# EAGLE design Modular Assistive Technology Interface (EAGLE 9.6.2)
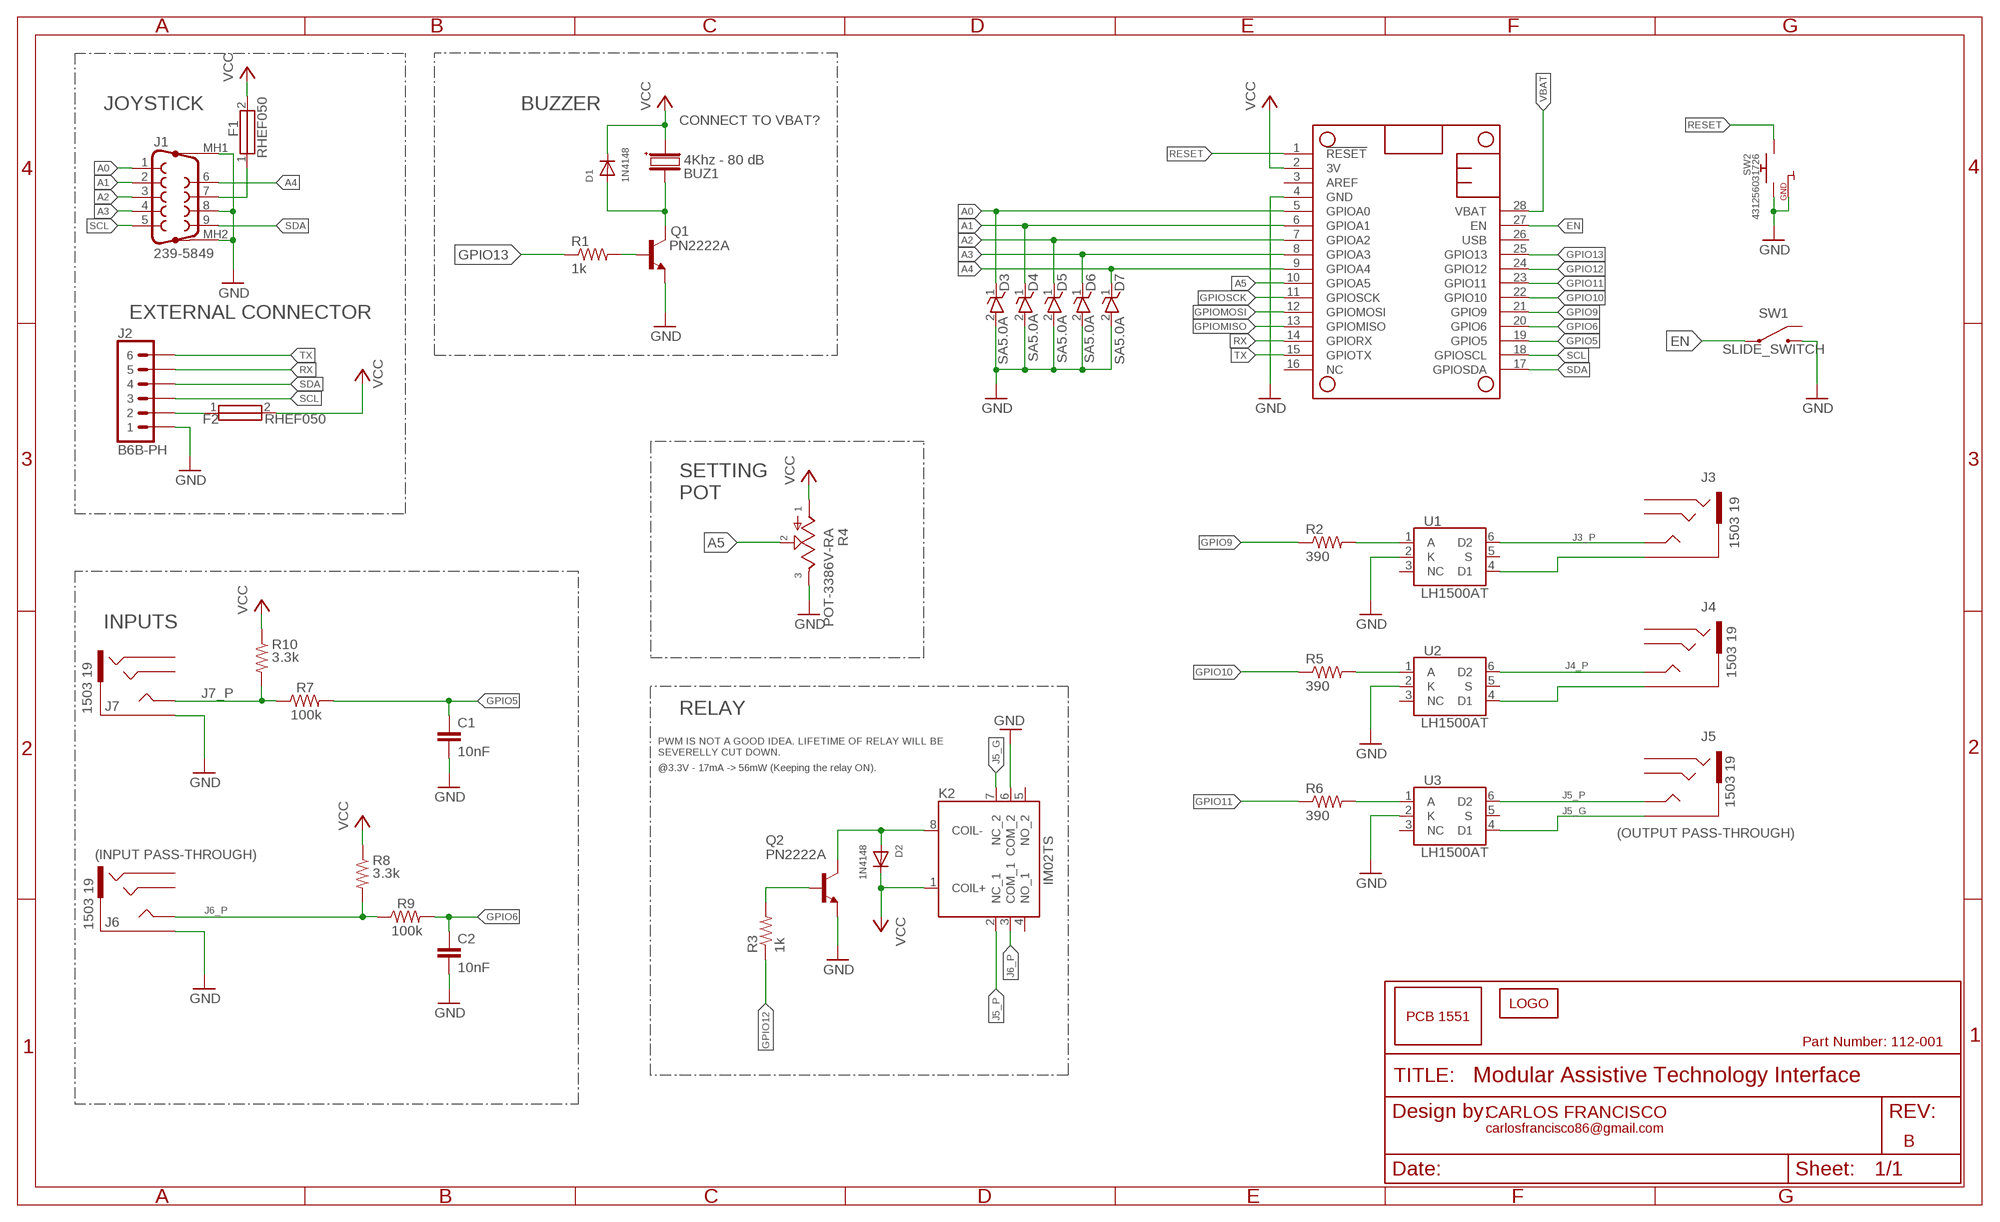
[diagram p0: schematic, sheet 1]

## Parts
BUZ1  4Khz - 80 dB  BUZZER-511-7620  [-511-7620]
C1  10nF  C-EU025-024X044  [C025-024X044]
C2  10nF  C-EU025-024X044  [C025-024X044]
D1  1N4148  DIODE-DO-35  [DO-1N4148]
D2  1N4148  DIODE-DO-35  [DO-1N4148]
D3  SA5.0A  ESD_DIODE  [DIOAD1910W86L670D310]
D4  SA5.0A  ESD_DIODE  [DIOAD1910W86L670D310]
D5  SA5.0A  ESD_DIODE  [DIOAD1910W86L670D310]
D6  SA5.0A  ESD_DIODE  [DIOAD1910W86L670D310]
D7  SA5.0A  ESD_DIODE  [DIOAD1910W86L670D310]
F1  RHEF050  [RHEF050]
F2  RHEF050  [RHEF050]
J1  239-5849  DB9_MALE-SLOTS  [DB9_PLUG_SLOT]
J2  B6B-PH  CONN_06-B6B-PH  [SHDR6W50P0X200_1X6_990X450X600]
J3  1503 19  STEREO_JACK-1503-19  [1503-19]
J4  1503 19  STEREO_JACK-1503-19  [1503-19]
J5  1503 19  STEREO_JACK-1503-19  [1503-19]
J6  1503 19  STEREO_JACK-1503-19  [1503-19]
J7  1503 19  STEREO_JACK-1503-19  [1503-19]
K2  IM02TS  IM02TS  [IM03TS114620378]
MS1  FEATHERWING_NODIM  [FEATHERWING_DIM]
Q1  PN2222A  NPN-TO-92  [TO92-EBC-OVAL]
Q2  PN2222A  NPN-TO-92  [TO92-EBC-OVAL]
R1  1k  R-US_0207/10  [0207/10]
R2  390  R-US_0207/10  [0207/10]
R3  1k  R-US_0207/10  [0207/10]
R4  POT-3386V-RA  [3386V1103LF]
R5  390  R-US_0207/10  [0207/10]
R6  390  R-US_0207/10  [0207/10]
R7  100k  R-US_0207/10  [0207/10]
R8  3.3k  R-US_0207/10  [0207/10]
R9  100k  R-US_0207/10  [0207/10]
R10  3.3k  R-US_0207/10  [0207/10]
SW1  SLIDE_SWITCH  [OS102011MA1QN1]
SW2  431256031726  SPST-RA  [SERIES95C_RA]
U1  LH1500AT  SSR-LH1500AT  [DIP762W47P254L880H410Q6N]
U2  LH1500AT  SSR-LH1500AT  [DIP762W47P254L880H410Q6N]
U3  LH1500AT  SSR-LH1500AT  [DIP762W47P254L880H410Q6N]
U$2  LOGO-10MM  [LOGO_10MM]
U$3  PCB_1551-1551  [PCB]

## Nets
A0: D3.1(K) J1.1 MS1.5(GPIOA0)
A1: D4.1(K) J1.2 MS1.6(GPIOA1)
A2: D5.1(K) J1.3 MS1.7(GPIOA2)
A3: D6.1(K) J1.4 MS1.8(GPIOA3)
A4: D7.1(K) J1.6 MS1.9(GPIOA4)
A5: MS1.10(GPIOA5) R4.2
BUZ_CTRL_R: Q1.B R1.2
EN: MS1.27(EN) SW1.2
GND: C1.2 C2.2 D3.2(A) D4.2(A) D5.2(A) D6.2(A) D7.2(A) J1.8 J1.MH1(G1) J1.MH2(G2) J2.1 J6.1 J7.1 K2.6(COM_2) MS1.4(GND) Q1.E Q2.E R4.3 SW1.1 SW2.F1(GND) SW2.F2(GND) SW2.T2(SW2) U1.2(K) U2.2(K) U3.2(K)
GPIO5: C1.1 MS1.19(GPIO5) R7.2
GPIO6: C2.1 MS1.20(GPIO6) R9.2
GPIO9: MS1.21(GPIO9) R2.1
GPIO10: MS1.22(GPIO10) R5.1
GPIO11: MS1.23(GPIO11) R6.1
GPIO12: MS1.24(GPIO12) R3.1
GPIO13: MS1.25(GPIO13) R1.1
GPIOMISO: MS1.13(GPIOMISO)
GPIOMOSI: MS1.12(GPIOMOSI)
GPIOSCK: MS1.11(GPIOSCK)
J3_P: J3.4 J3.5 U1.6(D2)
J4_P: J4.4 J4.5 U2.6(D2)
J5_G: J5.1 K2.7(NC_2) U3.4(D1)
J5_P: J5.4 J5.5 K2.2(NC_1) U3.6(D2)
J6_P: J6.4 J6.5 K2.3(COM_1) R8.2 R9.1
J7_P: J7.4 J7.5 R7.1 R10.2
N$1: BUZ1.- D1.A Q1.C
N$2: J3.1 U1.4(D1)
N$3: J4.1 U2.4(D1)
N$6: R2.2 U1.1(A)
N$8: R5.2 U2.1(A)
N$10: R6.2 U3.1(A)
N$13: F2.1 J2.2
N$14: D2.A K2.8(COIL-) Q2.C
N$19: Q2.B R3.2
N$20: F1.1 J1.7
RESET: MS1.1(!RESET) SW2.T1(SW1)
RX: J2.5 MS1.14(GPIORX)
SCL: J1.5 J2.3 MS1.18(GPIOSCL)
SDA: J1.9 J2.4 MS1.17(GPIOSDA)
TX: J2.6 MS1.15(GPIOTX)
VBAT: MS1.28(VBAT)
VCC: BUZ1.+ D1.C D2.C F1.2 F2.2 K2.1(COIL+) MS1.2(3V) R4.1 R8.1 R10.1
Unconnected: J3.2 J3.3 J4.2 J4.3 J5.2 J5.3 J6.2 J6.3 J7.2 J7.3 K2.4(NO_1) K2.5(NO_2) MS1.3(AREF) MS1.16(NC) MS1.26(USB) SW1.3 U1.3(NC) U1.5(S) U2.3(NC) U2.5(S) U3.3(NC) U3.5(S)

## Notes on the sheet
- JOYSTICK | BUZZER
- CONNECT TO VBAT?
- EXTERNAL CONNECTOR
- SETTING
  POT
- INPUTS
- RELAY
- PWM IS NOT A GOOD IDEA. LIFETIME OF RELAY WILL BE
  SEVERELLY CUT DOWN.
- @3.3V - 17mA -> 56mW (Keeping the relay ON).
- (OUTPUT PASS-THROUGH)
- (INPUT PASS-THROUGH)
- Part Number: 112-001
- CARLOS FRANCISCO
- carlosfrancisco86@gmail.com
- B

## Library data of the parts
BUZ1 = AceCenter:BUZZER: Buzzer; DESCRIPTION: 80dB PCB Buzzer; MFR: RS PRO; MFR_NUM: 511-7620
C1 C2 = rcl:C-EU: CAPACITOR, European symbol; SPICEPREFIX: C
D1 D2 = AceCenter:DIODE: General purpose diode; DESCRIPTION: Switching Diode, 400mA 100V, 2-Pin DO-35; MFR: ON Semiconductor; MFR_NUM: 1N4148TR; VENDOR_NUM: 671-5477
D3-D7 = AceCenter:ESD_DIODE: Littelfuse SA5.0A, Uni-Directional TVS Diode, 500W, 2-Pin DO-204AC Source: Datasheet <http://www.littelfuse.com/~/media/electronics/datasheets/tvs_diodes/littelfuse_tvs_diode_sa_datasheet.pdf.pdf>; DESCRIPTION: Littelfuse SA5.0A, Uni-Directional TVS Diode, 500W, 2-Pin DO-204AC; MFR: Littelfuse; MFR_NUM: SA5.0A; VENDOR: RS-ONLINE; VENDOR_NUM: 764-5521
F1 F2 = AceCenter:RHEF050: TE Connectivity 0.5A Radial Leaded PCB Mount Resettable Fuse, 30 V Source: Datasheet <http://www.littelfuse.com/~/media/electronics/product_specifications/resettable_ptcs/littelfuse_ptc_rhef050_product_specification.pdf.pdf>; ARROW_PART_NUMBER: RHEF050; DESCRIPTION: TE Connectivity 0.5A Radial Leaded PCB Mount Resettable Fuse, 30 V; HEIGHT: 12mm; MANUFACTURER_NAME: TE Connectivity; MANUFACTURER_PART_NUMBER: RHEF050
J1 = AceCenter:DB9_MALE: D-SUB Connector - Right Angle; DESCRIPTION: D-sub Connector - 2.77mm Pitch; MFR: RS Pro; MFR_NUM: 239-5849; VENDOR: RS-Online; VENDOR_NUM: 239-5849
J2 = AceCenter:CONN_06; DESCRIPTION: JST, PH, B6B, 6 Way, 1 Row, Straight PCB Header; MFR: JST; MFR_NUM: B6B-PH-K-S(LF)(SN); VENDOR: RS-ONLINE; VENDOR_NUM: 820-1447
J3-J7 = AceCenter:STEREO_JACK: 3.5 mm PCB Mount Stereo Jack Socket; DESCRIPTION: Lumberg 3.5 mm PCB Mount Stereo Jack Socket, 4Pole 1A; MFR: Lumberg; MFR_NUM: 1503 19; VENDOR: RS-ONLINE; VENDOR_NUM: 124-8885
K2 = AceCenter:IM02TS: DPDT telecom PCB relay, 2A 5Vdc coil, EA Source: Datasheet <http://uk.rs-online.com/web/p/products/4227029>; DESCRIPTION: DPDT telecom PCB relay, 2A 5Vdc coil, EA; MANUFACTURER_NAME: TE Connectivity; MANUFACTURER_PART_NUMBER: IM03TS 1-1462037-8
MS1 = AceCenter:FEATHERWING
Q1 Q2 = AceCenter:NPN; DESCRIPTION: NPN General-Purpose Amplifier; MFR: ON Semiconductor; MFR_NUM: PN2222ABU; VENDOR: RS-ONLINE; VENDOR_NUM: 739-0555
R1-R3 R5-R10 = rcl:R-US_: RESISTOR, American symbol; SPICEPREFIX: R
R4 = AceCenter:POT: Bourns 3386P Series Through Hole Cermet Trimmer Resistor with Solder Pin Terminations, 20 +/-10% 0.5W +/-100ppm/C Source: Datasheet <https://www.bourns.com/docs/Product-Datasheets/3386.pdf>
SW1 = AceCenter:SLIDE_SWITCH: Switch Slide Right Angle SPDT 0.1A 12VDC Through Hole Slide Switch SPDT On-On 0.1 A@ 12 V dc Slide Source: Datasheet <http://www.ckswitches.com/media/1428/os.pdf>; ARROW_PART_NUMBER: OS102011MA1QN1; ARROW_PRICE-STOCK: https://www.arrow.com/en/products/os102011ma1qn1/ck; DESCRIPTION: Switch Slide Right Angle SPDT 0.1A 12VDC Through Hole Slide Switch SPDT On-On 0.1 A@ 12 V dc Slide; HEIGHT: mm; MANUFACTURER_NAME: C & K COMPONENTS; MANUFACTURER_PART_NUMBER: OS102011MA1QN1; MOUSER_PART_NUMBER: 611-OS102011MA1QN1; MOUSER_PRICE-STOCK: https://www.mouser.co.uk/ProductDetail/CK/OS102011MA1QN1?qs=WtljUlYws5R6MUgHcLkz4w%3D%3D
SW2 = AceCenter:SPST; DESCRIPTION: Tactile Switch, Single Pole Single Throw (SPST) 50 mA @ 12 V; MFR: Wurth Elektronik; MFR_NUM: 431256031726; VENDOR: RS-ONLINE; VENDOR_NUM: 785-6386
U1-U3 = AceCenter:SSR: Vishay 1 Form A Solid-State Relay (Normally Open); DESCRIPTION: 1 Form A Solid-State Relay (NO); MFR: Vishay; MFR_NUM: LH1500AT; VENDOR: RS-ONLINE; VENDOR_NUM: 180-8794
U$2 = AceCenter:LOGO
U$3 = AceCenter:PCB_1551

## Board
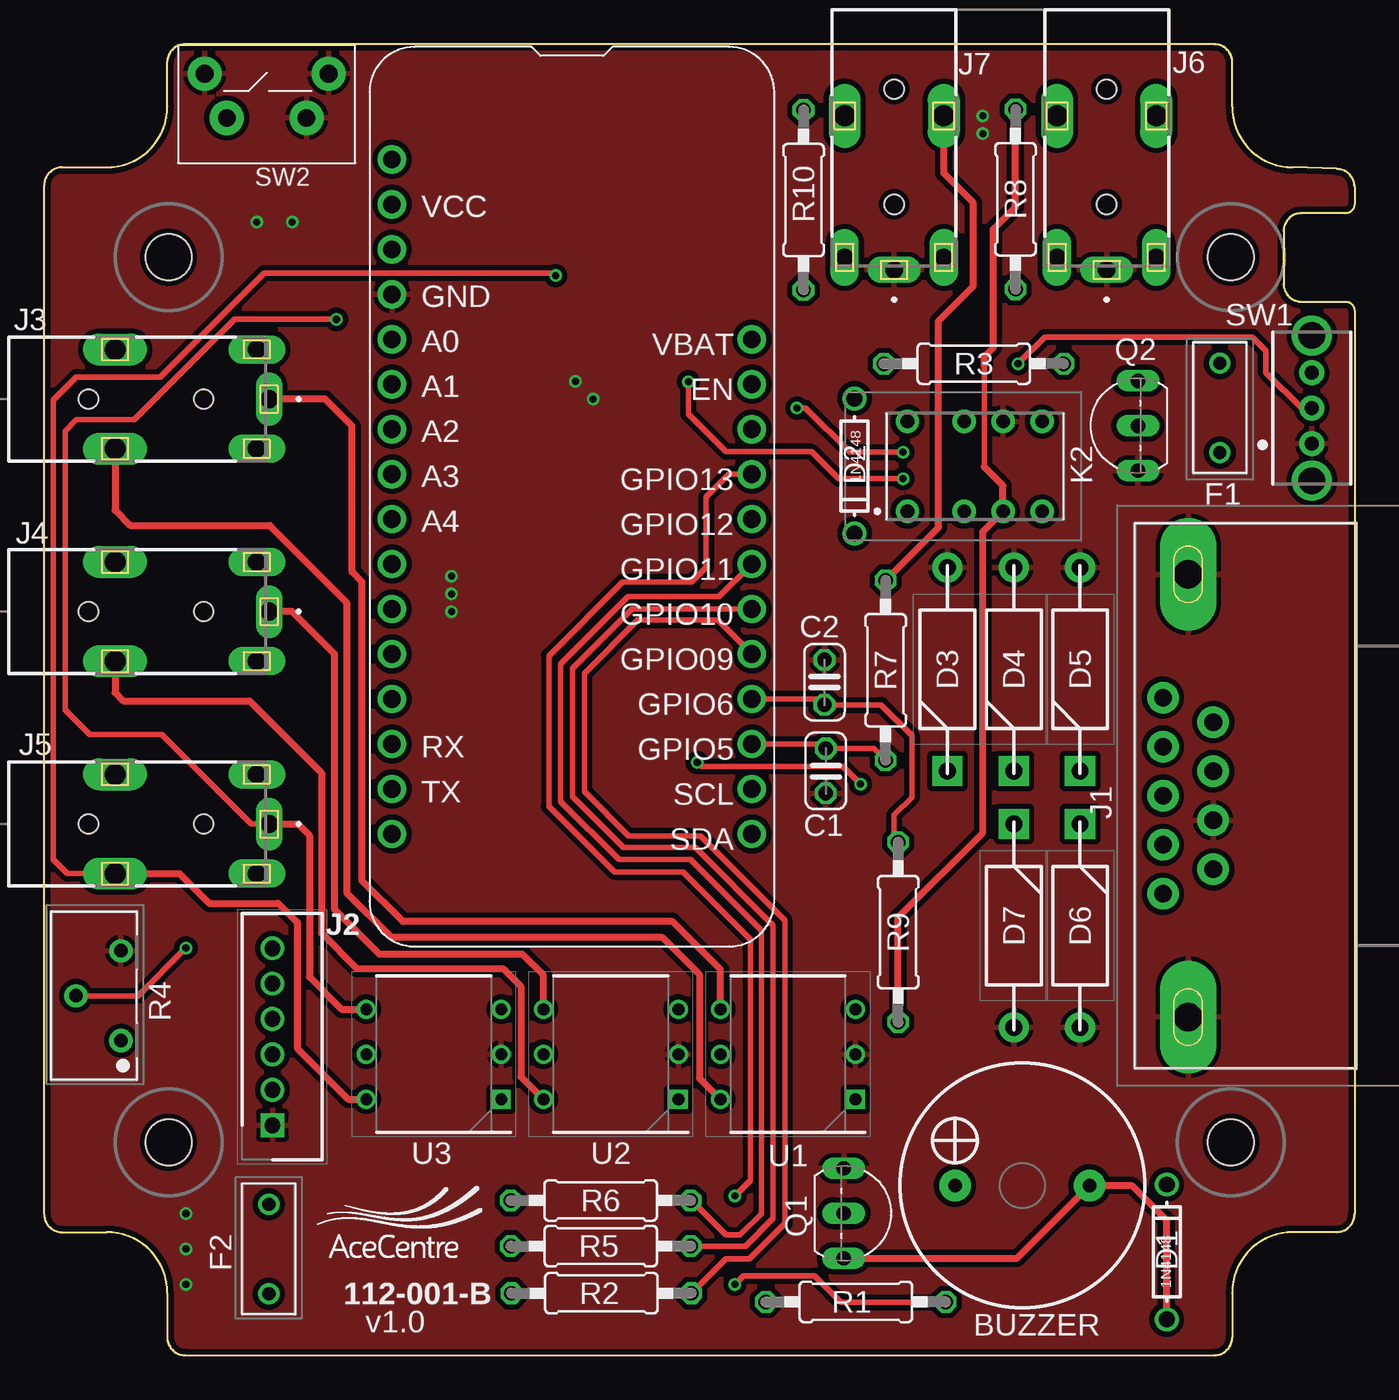
[diagram p1: board, top side]
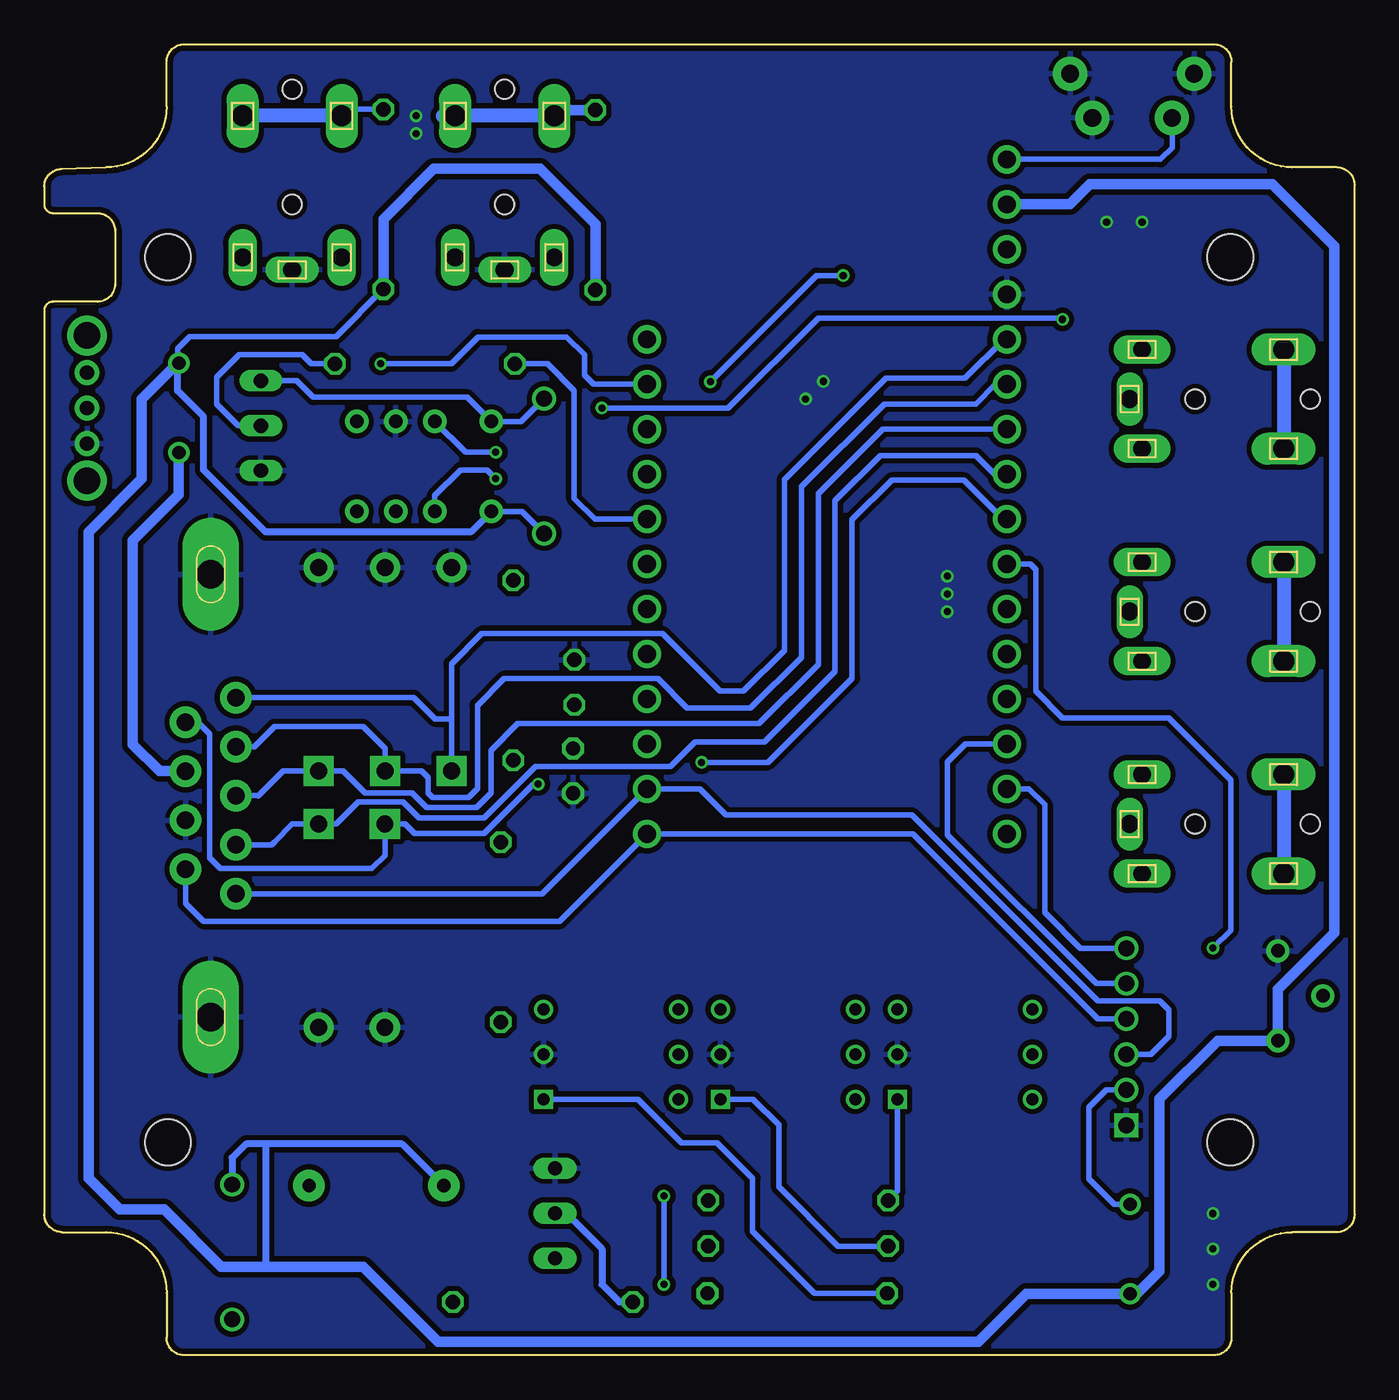
[diagram p2: board, bottom side, seen from below]

Size 74 x 74.04 mm. Coordinates in mm from the lower left corner, seen from the top.
Copper layers (1*16): Top 0.035mm / dielectric 1.5mm / Bottom 0.035mm
Design rules "SparkFun-2-layer-PCBWay-LIMIT": minimum track width 6mil, minimum drill 0.3mm, track to track 6mil, track to pad 6mil, pad to pad 6mil, via to via 6mil, smd to smd 6mil, copper to edge 6mil, drill to drill 6mil, minimum pad ring 6mil, minimum via ring 6mil, stop-mask expansion 4mil, vias tented up to drill 25mil, thermal gap 10mil

### Footprints (pad centres in the part's own frame; a part is rotated, then mirrored left to right if it is on the bottom)
-511-7620 = drill 0.75 pad 1.778: + 0,3.8; - 0,-3.8
C025-024X044 = drill 0.813 octagon: 1 -1.27,0; 2 1.27,0
DO-1N4148 = drill 0.9: A -3.81,0; C 3.81,0
DIOAD1910W86L670D310 = drill 0.95 pad 1.7 square: 1 0,0 | drill 0.95 pad 1.7: 2 11.48,0
RHEF050 = drill 0.75 pad 1.2: 1 -2.525,0; 2 2.525,0
DB9_PLUG_SLOT = drill 1 pad 1.778: 1 0,0; 2 -2.77,0; 3 -5.54,0; 4 -8.31,0; 5 -11.08,0; 6 -1.385,-2.84; 7 -4.155,-2.84; 8 -6.925,-2.84; 9 -9.695,-2.84 | drill 1.6 pad 3.2 long: MH1 -18.04,-1.42; MH2 6.96,-1.42
SHDR6W50P0X200_1X6_990X450X600 = drill 0.9 pad 1.35 square: 1 0,0 | drill 0.9 pad 1.35: 2 -2,0; 3 -4,0; 4 -6,0; 5 -8,0; 6 -10,0
1503-19 = drill 1 pad 1.5 long: 1 14.7,0 | drill 1 pad 1.6 long: 2 14,2.8; 3 14,-2.8 | drill 1.2 pad 1.8 long: 4 6,2.8; 5 6,-2.8 | hole 1.1: 4.5,0; 11,0
IM03TS114620378 = drill 0.77 pad 1.32: 1 0,0; 2 3.2,0; 3 5.4,0; 4 7.6,0; 5 7.6,5.08; 6 5.4,5.08; 7 3.2,5.08; 8 0,5.08
FEATHERWING_DIM = drill 1 pad 1.6: 1 6.35,1.27; 2 8.89,1.27; 3 11.43,1.27; 4 13.97,1.27; 5 16.51,1.27; 6 19.05,1.27; 7 21.59,1.27; 8 24.13,1.27; 9 26.67,1.27; 10 29.21,1.27; 11 31.75,1.27; 12 34.29,1.27; 13 36.83,1.27; 14 39.37,1.27; 15 41.91,1.27; 16 44.45,1.27; 17 44.45,21.59; 18 41.91,21.59; 19 39.37,21.59; 20 36.83,21.59; 21 34.29,21.59; 22 31.75,21.59; 23 29.21,21.59; 24 26.67,21.59; 25 24.13,21.59; 26 21.59,21.59; 27 19.05,21.59; 28 16.51,21.59
TO92-EBC-OVAL = drill 0.813 long: B 0,-1.27; C 2.54,-1.27; E -2.54,-1.27
0207/10 = drill 0.813 octagon: 1 -5.08,0; 2 5.08,0
3386V1103LF = drill 0.76 pad 1.303: 1 0,0; 2 2.54,2.54; 3 5.08,0
OS102011MA1QN1 = drill 0.8 pad 1.4: 1 -2,0; 2 0,0; 3 2,0 | drill 1.5 pad 2.25: 4 -4.1,0; 5 4.1,0
SERIES95C_RA = drill 1 pad 1.93: F1 -3.5,2.5; F2 3.5,2.5; T1 -2.25,0; T2 2.25,0
DIP762W47P254L880H410Q6N = drill 0.67 pad 1.07 square: 1 -3.81,2.54 | drill 0.67 pad 1.07: 2 -3.81,0; 3 -3.81,-2.54; 4 3.81,-2.54; 5 3.81,0; 6 3.81,2.54
PCB = hole 2.6: 7.02,12.02; 67.02,12.02; 7.02,62.02; 67.02,62.02

### Placement (x,y rotation side)
BUZ1  55.24,9.58 90 top
C1  44.13,33 270 top
C2  44.06,38 90 top
D1  63.4,5.83 90 top
D2  45.76,50.23 270 top
D3  51,33 90 top
D4  54.75,33 90 top
D5  58.5,33 90 top
D6  58.5,30 270 top
D7  54.76,30 270 top
F1  66.4,53.51 90 top
F2  12.68,6 270 top
J1  63.18,37.14 90 top
J2  12.88,12.99 270 top
J3  -2,54 0 top
J4  -2,42 0 top
J5  -2,30 0 top
J6  60,76 270 top
J7  48,76 270 top
K2  48.75,47.66 0 top
MS1  18.37,73.89 270 top
Q1  46.42,8.02 270 top
Q2  60.5,52.5 90 top
R1  45.84,3.01 180 top
R2  31.46,3.5 180 top
R3  52.5,56 0 top
R4  4.33,17.77 90 top
R5  31.43,6.17 180 top
R6  31.42,8.74 180 top
R7  47.51,38.68 270 top
R8  54.85,65.29 90 top
R9  48.22,23.9 90 top
R10  42.88,65.24 90 top
SW1  71.59,53.49 90 top
SW2  12.56,69.88 0 top
U1  42,17 180 top
U2  32,17 180 top
U3  22,17 180 top
U$2  15.39,5.42 0 top
U$3  0,0 0 top

### Tracks (layer width: path | path; a pad name or v marks a point on that pad's centre or on a via)
A0
  Bottom 0.3: 51,35.94 D3.1 | MS1.5 19.79,57.38 21.99,55.17 26.46,55.17 32.19,49.44 32.19,39.81 34.5,37.5 35.85,37.5 39.1,40.75 49.3,40.75 51,39.04 51,35.94 | 51,35.94 51.94,35.94 53,37 53.12,37.12 53.14,37.14 J1.1
A1
  Bottom 0.3: MS1.6 20.27,54.84 21.39,53.72 26.56,53.72 31.24,49.05 31.24,39.42 34.1,36.55 37.69,36.55 39.35,38.21 48.03,38.21 49.53,36.7 49.53,32 50.04,31.5 52.07,31.5 52.32,31.75 52.32,32.64 52.69,33 D4.1 54.75,34.25 56,35.5 61,35.5 62.15,34.35 62.17,34.37 J1.2
A2
  Bottom 0.3: 61.92,31.58 61.9,31.6 | MS1.7 26.64,52.3 30.29,48.65 30.29,39.02 33.64,35.67 47.26,35.67 48.77,34.16 48.77,31.75 49.59,30.93 52.4,30.93 53.21,31.75 55.88,31.75 57.13,33 D5.1 60.5,33 61.75,31.75 61.9,31.6 | J1.3 61.9,31.6
A3
  Bottom 0.3: 61.19,28.81 61.17,28.83 | MS1.8 20.34,49.76 21.39,50.82 26.77,50.82 29.33,48.26 29.33,38.63 33.32,34.64 37.24,34.64 38.63,33.25 46.25,33.25 49.16,30.35 52.83,30.35 53.72,31.24 56.26,31.24 57.5,30 D6.1 60,30 61,29 61.17,28.83 | J1.4 61.17,28.83
A4  (via drill 0.4)
  Top 0.3: v46.1,32.26 45.1,33.25 37.11,33.25 v36.88,33.48
  Bottom 0.3: MS1.9 19.85,47.22 22.05,49.42 26.14,49.42 28.38,47.19 28.38,38.23 33.13,33.48 v36.88,33.48 | v46.1,32.26 46.35,32.26 49.15,29.46 53.09,29.46 53.62,30 D7.1 54.76,28.24 55.5,27.5 64.08,27.5 64.67,28.09 64.67,35.09 65.33,35.76 J1.6
A5  (via drill 0.4)
  Top 0.3: R4.2 5.31,20.31 v8,23
  Bottom 0.3: MS1.10 18.32,44.68 18,44.36 18,37.5 16.5,36 10.5,36 7,32.5 7,24 v8,23
BUZ_CTRL_R
  Bottom 0.4: Q1.B 44.52,8.02 42.5,6 42.5,4 41.51,3.01 R1.2
EN  (via drill 0.4)
  Top 0.3: SW1.2 71.01,53.49 69,55.5 69,56.73 68.23,57.5 56.5,57.5 v55,56
  Bottom 0.3: v55,56 51,56 49.5,57.5 44.5,57.5 43.5,56.5 43.5,55.37 42.98,54.84 MS1.27
GND  (via drill 0.4)
  other vias: 8,6 8,4 8,8 12,64 14,64 23,44 23,43 23,42 30,55 31,54 53,69 53,70
  pour Top (isolate 0.3): 4,74 70,74 arc-90 74,70 74,1 arc-90 73,0 0,0 0,70 arc-90
  pour Bottom (isolate 0.3): 0,71 0,0 73,0 arc90 74,1 74,70 arc90 70,74 3,74 arc90
GPIO5
  Top 0.3: MS1.19 43.88,34.52 C1.1 46.85,34.27 R7.2
GPIO6
  Top 0.3: MS1.20 43.74,37.06 C2.1 47.27,36.73 49,35 49,31.5 48,30.5 48,29.2 R9.2
GPIO9
  Top 0.3: MS1.21 38.05,41.51 33.51,41.51 30.5,38.5 30.5,31.83 33,29.33 37.05,29.33 41.83,24.55 41.83,7.45 39.84,5.46 38.5,5.46 R2.1
GPIO10
  Top 0.3: R5.1 39.61,6.17 41.16,7.72 41.16,24.28 36.78,28.66 32.72,28.66 29.84,31.55 29.84,38.78 33.2,42.14 MS1.22
GPIO11
  Top 0.3: R6.1 36.54,8.74 38.5,6.79 39.29,6.79 40.5,8 40.5,24 36.5,28 32.45,28 29.17,31.28 29.17,39.05 32.96,42.84 38.12,42.84 MS1.23
GPIO12
  Bottom 0.3: MS1.24 42.9,47.22 44.07,48.39 44.07,54.48 45.59,56 R3.1
GPIO13  (via drill 0.4)
  Top 0.3: MS1.25 38.66,49.76 37.38,48.48 37.38,44.48 36.57,43.67 32.67,43.67 28.5,39.5 28.5,31 32.2,27.3 36.07,27.3 39.88,23.5 39.88,9.88 v39,9 | v39,4 39.5,4.5 43.5,4.5 45,3 50.9,3 R1.1
  Bottom 0.3: v39,9 v39,4
J3_P
  Top 0.4: J3.5 4,47.72 4.86,46.86 12.73,46.86 17.09,42.51 17.09,26.11 19.58,23.62 34.88,23.62 37,21.5 37,15.65 U1.6
  Bottom 0.8: J3.4 J3.5
J4_P
  Top 0.4: J4.5 4,37.42 4.46,36.96 11.59,36.96 15.66,32.89 15.66,23.84 17.65,21.84 25.91,21.84 26.92,20.83 26.92,15.73 U2.6
  Bottom 0.8: J4.4 J4.5
J5_G  (via drill 0.4)
  Top 0.3: J5.1 11.69,30 6.64,35.05 2.57,35.05 1.18,36.45 1.18,52.2 1.81,52.83 5.08,52.83 10.75,58.5 v16.5,58.5 | v42.5,53.5 43,53.5 45.5,51 v48.5,51
  Top 0.4: J5.1 14.34,30 14.98,29.36 14.98,21.36 16.79,19.54 U3.4
  Bottom 0.3: v16.5,58.5 16.57,58.57 30.29,58.57 35.38,53.48 42.12,53.48 42.14,53.5 v42.5,53.5 | v48.5,51 50.21,51 K2.7
J5_P  (via drill 0.4)
  Top 0.3: J5.5 1.3,27.2 0.5,28 0.5,53.94 1.81,55.24 6.56,55.24 12.43,61.12 28.74,61.12 v28.88,60.98 | v48.5,49.5 44.86,49.5 43.33,51.03 38.5,51.03 36.38,53.16 v36.38,54.98
  Top 0.4: J5.5 7.63,27.2 9.3,25.53 13.21,25.53 14.29,24.45 14.29,17.33 17.16,14.46 U3.6
  Bottom 0.3: K2.2 51.95,48.55 50.5,50 49,50 v48.5,49.5 | v36.38,54.98 30.38,60.98 v28.88,60.98
  Bottom 0.8: J5.4 J5.5
J6_P
  Top 0.3: 53.09,50.16 53.09,55.88
  Top 0.4: R9.1 48.22,24.72 53,29.5 53,46.51 K2.3 54.15,49.1 53.09,50.16 | 53.09,55.88 53.09,56.39 53.59,56.9 53.59,63.59 54.85,64.85 R8.2
  Bottom 0.3: R8.2 56.83,70.37 J6.5
  Bottom 0.8: J6.5 J6.4
J7_P
  Top 0.4: R7.1 50.5,46.75 50.5,58.41 52.47,60.38 52.47,65.09 50.8,66.76 J7.4
  Bottom 0.3: J7.5 J7.4 51.5,70
  Bottom 0.6: R10.2 44.88,70.32 J7.5
  Bottom 0.8: J7.5 51.5,70
N$1
  Top 0.4: Q1.C 54.93,5.48 BUZ1.- 61.42,9.58 63.37,7.63 63.37,2.05 D1.A
N$2
  Top 0.4: U1.4 38.19,21.79 35.49,24.49 20.26,24.49 17.95,26.8 17.95,43.68 17.38,44.25 17.38,52.48 15.86,54 J3.1
N$3
  Top 0.4: U2.4 28.19,21.47 27.01,22.65 18.93,22.65 16.4,25.18 16.4,39.6 14,42 J4.1
N$6
  Bottom 0.3: R2.2 30.5,3.5 34,7 34,10 36,12 38,12 40.46,14.46 U1.1
N$8
  Bottom 0.3: R5.2 29.17,6.17 32.5,9.5 32.5,13 33.96,14.46 U2.1
N$10
  Bottom 0.3: R6.2 25.81,9.28 U3.1
N$13
  Bottom 0.3: F2.1 13.56,8.53 15,9.96 15,14 14.01,14.99 J2.2
N$14
  Bottom 0.3: D2.A 47.06,52.74 K2.8 50.11,54.1 58.8,54.1 59.74,55.04 Q2.C
N$19
  Bottom 0.3: Q2.B 63.04,52.5 64.26,53.72 64.26,55.24 62.99,56.52 59.44,56.52 58.92,56 R3.2
N$20
  Bottom 0.6: F1.1 66.4,48.6 69,46 69,34.5 67.48,32.98 J1.7
RESET
  Bottom 0.3: MS1.1 10.96,67.54 10.29,68.21 10.29,69.86 SW2.T1
RX
  Bottom 0.3: MS1.14 21.98,34.52 23,33.5 23,29.39 14.59,20.99 J2.5
SCL
  Bottom 0.3: J2.3 11.51,16.99 10.5,18 10.5,19.5 11,20 14.5,20 25,30.5 35.5,30.5 36.98,31.98 MS1.18 45.9,26.04 45.92,26.06 J1.5
SDA
  Bottom 0.3: J2.4 14.49,18.99 24.94,29.44 MS1.17 44.89,24.51 65.01,24.51 66.03,25.52 J1.9
TX
  Bottom 0.3: MS1.15 18.38,31.98 17.5,31.1 17.5,25 15.49,22.99 J2.6
VCC
  Bottom 0.3: 54.83,60.19 R8.1 57.52,57.53 65.79,57.53 66.47,56.85 66.47,56.03 | D2.C 47.01,47.66 K2.1
  Bottom 0.4: D1.C 63.4,11.15 62.61,11.94 61.5,11.94 | K2.1 49.91,46.5 61.5,46.5 65,50 65,53 66.47,54.47 66.47,56.03 | 61.5,11.94 53.8,11.94 BUZ1.+ | 61.5,11.94 61.5,5
  Bottom 0.6: MS1.2 16.09,65 14.96,66.13 4.63,66.13 1.14,62.64 1.14,23.86 4.33,20.67 R4.1 7.73,17.77 11.02,14.48 11.02,4.75 12.29,3.48 F2.2 18.52,3.48 21.24,0.76 51.76,0.76 56,5 61.5,5 64,5 67.24,8.24 69.74,8.24 71.5,10 71.5,46.5 68.5,49.5 68.5,54 66.47,56.03 F1.2 | R10.1 42.88,63.88 46,67 52,67 54.83,64.17 54.83,60.19

### Text on the board
tPlace: VCC | GND | A0 | VBAT | A1 | EN | A2 | A3 | GPIO13 | A4 | GPIO12 | GPIO11 | GPIO10 | GPIO09 | GPIO6 | RX | GPIO5 | TX | SCL | SDA | 112-001-B | v1.0 | BUZZER